# Altium schematic sheet MCU_Transceiver_Board.SchDoc
size B; SheetNumber: 1; SheetTotal: 5
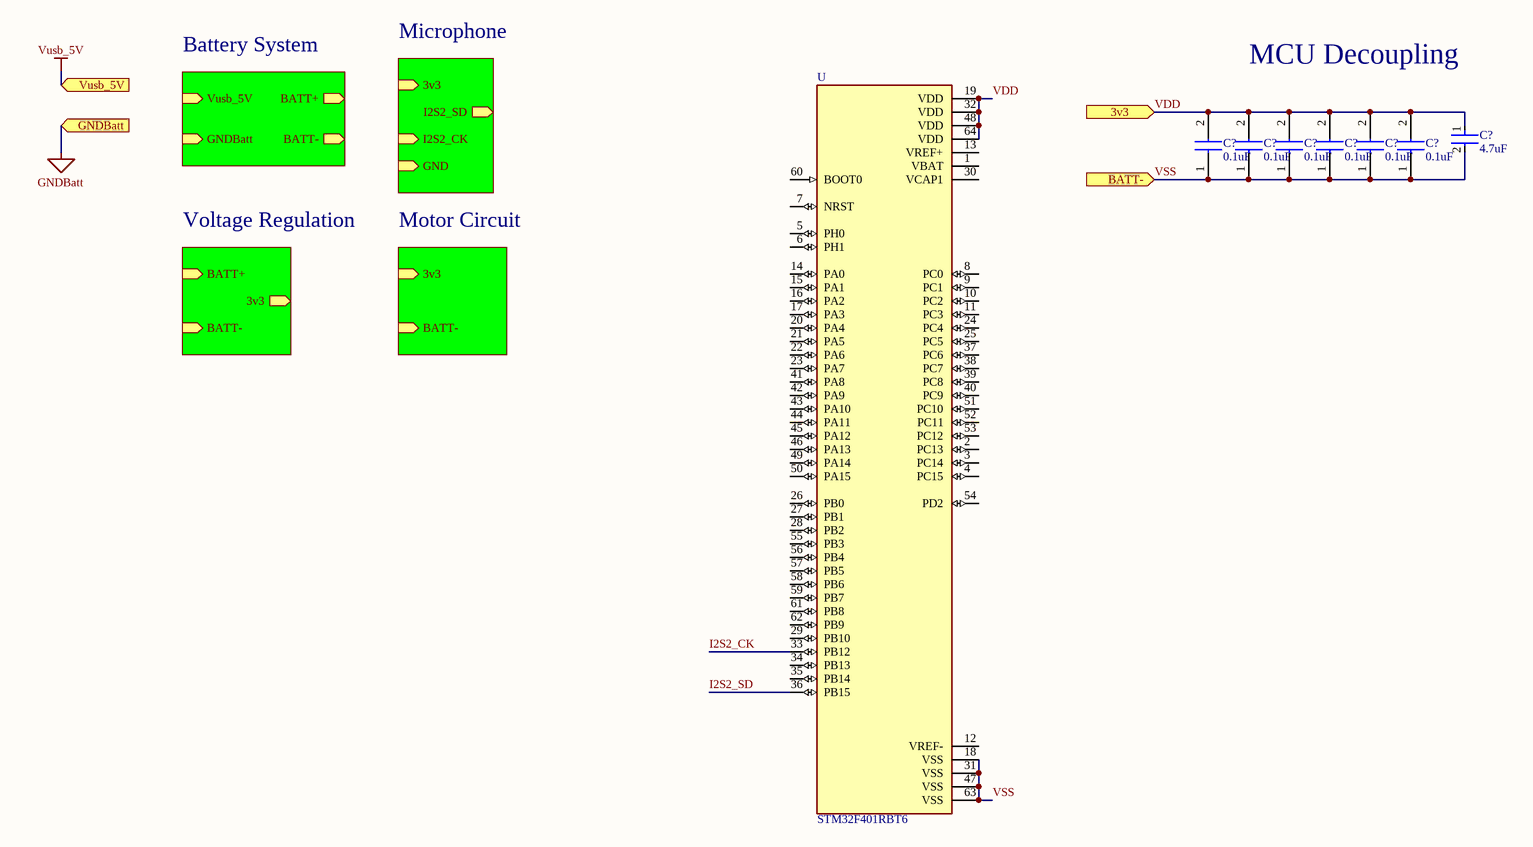
[diagram p0: MCU_Transceiver_Board.SchDoc]

## Parts
(Parts that share a designator on the sheet are numbered #1, #2 ... from top to bottom, then left to right.)
C?#1  4.7uF  [FP-1206-L_3_2_0_2-W_1_6_0-IPC_B]
C?#2  0.1uF  [CAPC3216X180N]
C?#3  0.1uF  [CAPC3216X180N]
C?#4  0.1uF  [CAPC3216X180N]
C?#5  0.1uF  [CAPC3216X180N]
C?#6  0.1uF  [CAPC3216X180N]
C?#7  0.1uF  [CAPC3216X180N]
U  STM32F401RBT6  [QFP50P1200X1200X160-64N]

## Sub-sheets
Battery System = Battery System: Vusb_5V (in), GNDBatt (in), BATT+ (out), BATT- (out)
Microphone = Microphone: 3v3 (in), I2S2_SD (out), I2S2_CK (in), GND (in)
Motor Circuit = Motor Circuit: 3v3 (in), BATT- (in)
Voltage Regulation = Voltage Regulation: BATT+ (in), BATT- (in), 3v3 (out)

## Ports
3v3 (in), BATT- (in), GNDBatt (in), Vusb_5V (in)

## Nets
GNDBatt: port GNDBatt
Vusb_5V: port Vusb_5V
I2S2_CK: U.33(PB12)
I2S2_SD: U.36(PB15)
VDD: C?#1.1 C?#2.2 C?#3.2 C?#4.2 C?#5.2 C?#6.2 C?#7.2 U.19(VDD) U.32(VDD) U.48(VDD) U.64(VDD) ; port 3v3
VSS: C?#1.2 C?#2.1 C?#3.1 C?#4.1 C?#5.1 C?#6.1 C?#7.1 U.18(VSS) U.31(VSS) U.47(VSS) U.63(VSS) ; port BATT-

Not connected (* = marked no-connect by the designer): U 1(VBAT) 2(PC13) 3(PC14) 4(PC15) 5(PH0) 6(PH1) 7(NRST) 8(PC0) 9(PC1) 10(PC2) 11(PC3) 12(VREF-) 13(VREF+) 14(PA0) 15(PA1) 16(PA2) 17(PA3) 20(PA4) 21(PA5) 22(PA6) 23(PA7) 24(PC4) 25(PC5) 26(PB0) 27(PB1) 28(PB2) 29(PB10) 30(VCAP1) 34(PB13) 35(PB14) 37(PC6) 38(PC7) 39(PC8) 40(PC9) 41(PA8) 42(PA9) 43(PA10) 44(PA11) 45(PA12) 46(PA13) 49(PA14) 50(PA15) 51(PC10) 52(PC11) 53(PC12) 54(PD2) 55(PB3) 56(PB4) 57(PB5) 58(PB6) 59(PB7) 60(BOOT0) 61(PB8) 62(PB9)

## Notes on the sheet
- MCU Decoupling

## Library data of the parts
C?#1 = CMP-04427-012562-1: General Purpose Ceramic Capacitor, 1206, 4.7uF, 20%, X5R, 15%, 16V, 1206YD475MAT2A; Dissipation Factor: 5%; Tolerance: 20%; Length: 3.2mm; Min Operating Temperature: -55°C; Width: 0.063inch; Capacitance: 4.7uF; Dielectric: X5R; Case Code (Imperial): 1206; Termination: SMD/SMT; Package Quantity: 1; Depth: 1.6mm; Height: 0.07mm; Voltage Rating: 16V; Mount: Surface Mount; Lead Free: Lead Free; Construction: Flat; Case/Package: 1206; Max Operating Temperature: 85°C; Contact Plating: Tin; Voltage Rating (DC): 16V; Series: -; Case Code (Metric): 3216; RoHS Compliant: Yes; Thickness: 0.07inch; Packaging: Tape and Reel; Number of Pins: 2; Radiation Hardening: No
C?#2 = GCM31C5C1H104FA16L: Capacitor, GCM31C5C1H104FA16L, 1206; Manufacturer_Name: Murata Electronics; Datasheet Link: https://www.digikey.in/product-detail/en/murata-electronics/GCM31C5C1H104FA16L/490-GCM31C5C1H104FA16LCT-ND/11618925; Height: 1.8mm; Manufacturer_Part_Number: GCM31C5C1H104FA16L; Mouser Part Number: 81-GCM31C5C1H104FA16; Mouser Price/Stock: https://www.mouser.co.uk/ProductDetail/Murata-Electronics/GCM31C5C1H104FA16L?qs=rrS6PyfT74fke0d0BEF0PA%3D%3D; Arrow Part Number: GCM31C5C1H104FA16L; Arrow Price/Stock: https://www.arrow.com/en/products/gcm31c5c1h104fa16l/murata-manufacturing
C?#3-C?#7 = GCM31C5C1H104FA16L: Capacitor, C5C1H104FA16L; Manufacturer_Name: Murata Electronics; Datasheet Link: https://www.digikey.in/product-detail/en/murata-electronics/GCM31C5C1H104FA16L/490-GCM31C5C1H104FA16LCT-ND/11618925; Height: 1.8mm; Manufacturer_Part_Number: GCM31C5C1H104FA16L; Mouser Part Number: 81-GCM31C5C1H104FA16; Mouser Price/Stock: https://www.mouser.co.uk/ProductDetail/Murata-Electronics/GCM31C5C1H104FA16L?qs=rrS6PyfT74fke0d0BEF0PA%3D%3D; Arrow Part Number: GCM31C5C1H104FA16L; Arrow Price/Stock: https://www.arrow.com/en/products/gcm31c5c1h104fa16l/murata-manufacturing
U = STM32F401RBT6: ARMÂ® CortexÂ®-M4 STM32F4 Microcontroller IC 32-Bit 84MHz 128KB _128K x 8_ FLASH 64-LQFP _10x10_; MF: STMicroelectronics; Availability: Unavailable; MP: STM32F401RBT6; Price: None; Value: *; SnapEDA_Link: https://www.snapeda.com/parts/STM32F401RBT6/STMicroelectronics/view-part/49021/?ref=snap; Package: LQFP-64 STMicroelectronics